# Altium schematic sheet TactileSens_8x5.SchDoc
size A; SheetNumber: 1; SheetTotal: 1
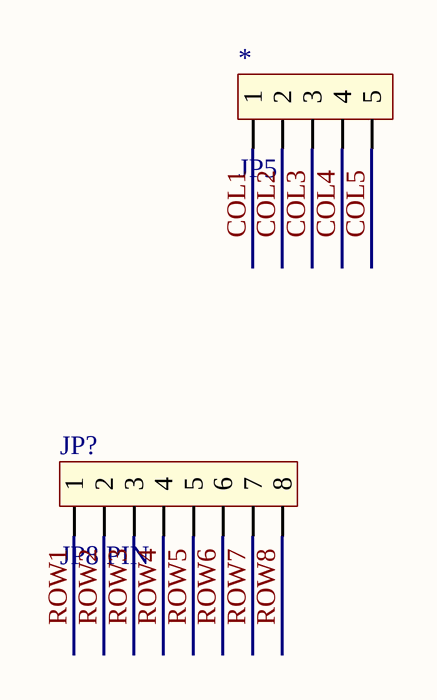
[diagram p0: TactileSens_8x5.SchDoc]

## Parts
*  JP5  [JP5]
JP?  JP8 PIN  [JP8]

## Nets
COL1: *.1
COL2: *.2
COL3: *.3
COL4: *.4
COL5: *.5
ROW1: JP?.1
ROW2: JP?.2
ROW3: JP?.3
ROW4: JP?.4
ROW5: JP?.5
ROW6: JP?.6
ROW7: JP?.7
ROW8: JP?.8

## Library data of the parts
JP? = JP8: Value: JP7